# EAGLE design Maqam v3a (EAGLE 9.2.2)

## Sheet 1 of 2: Maqam v2.0 Board
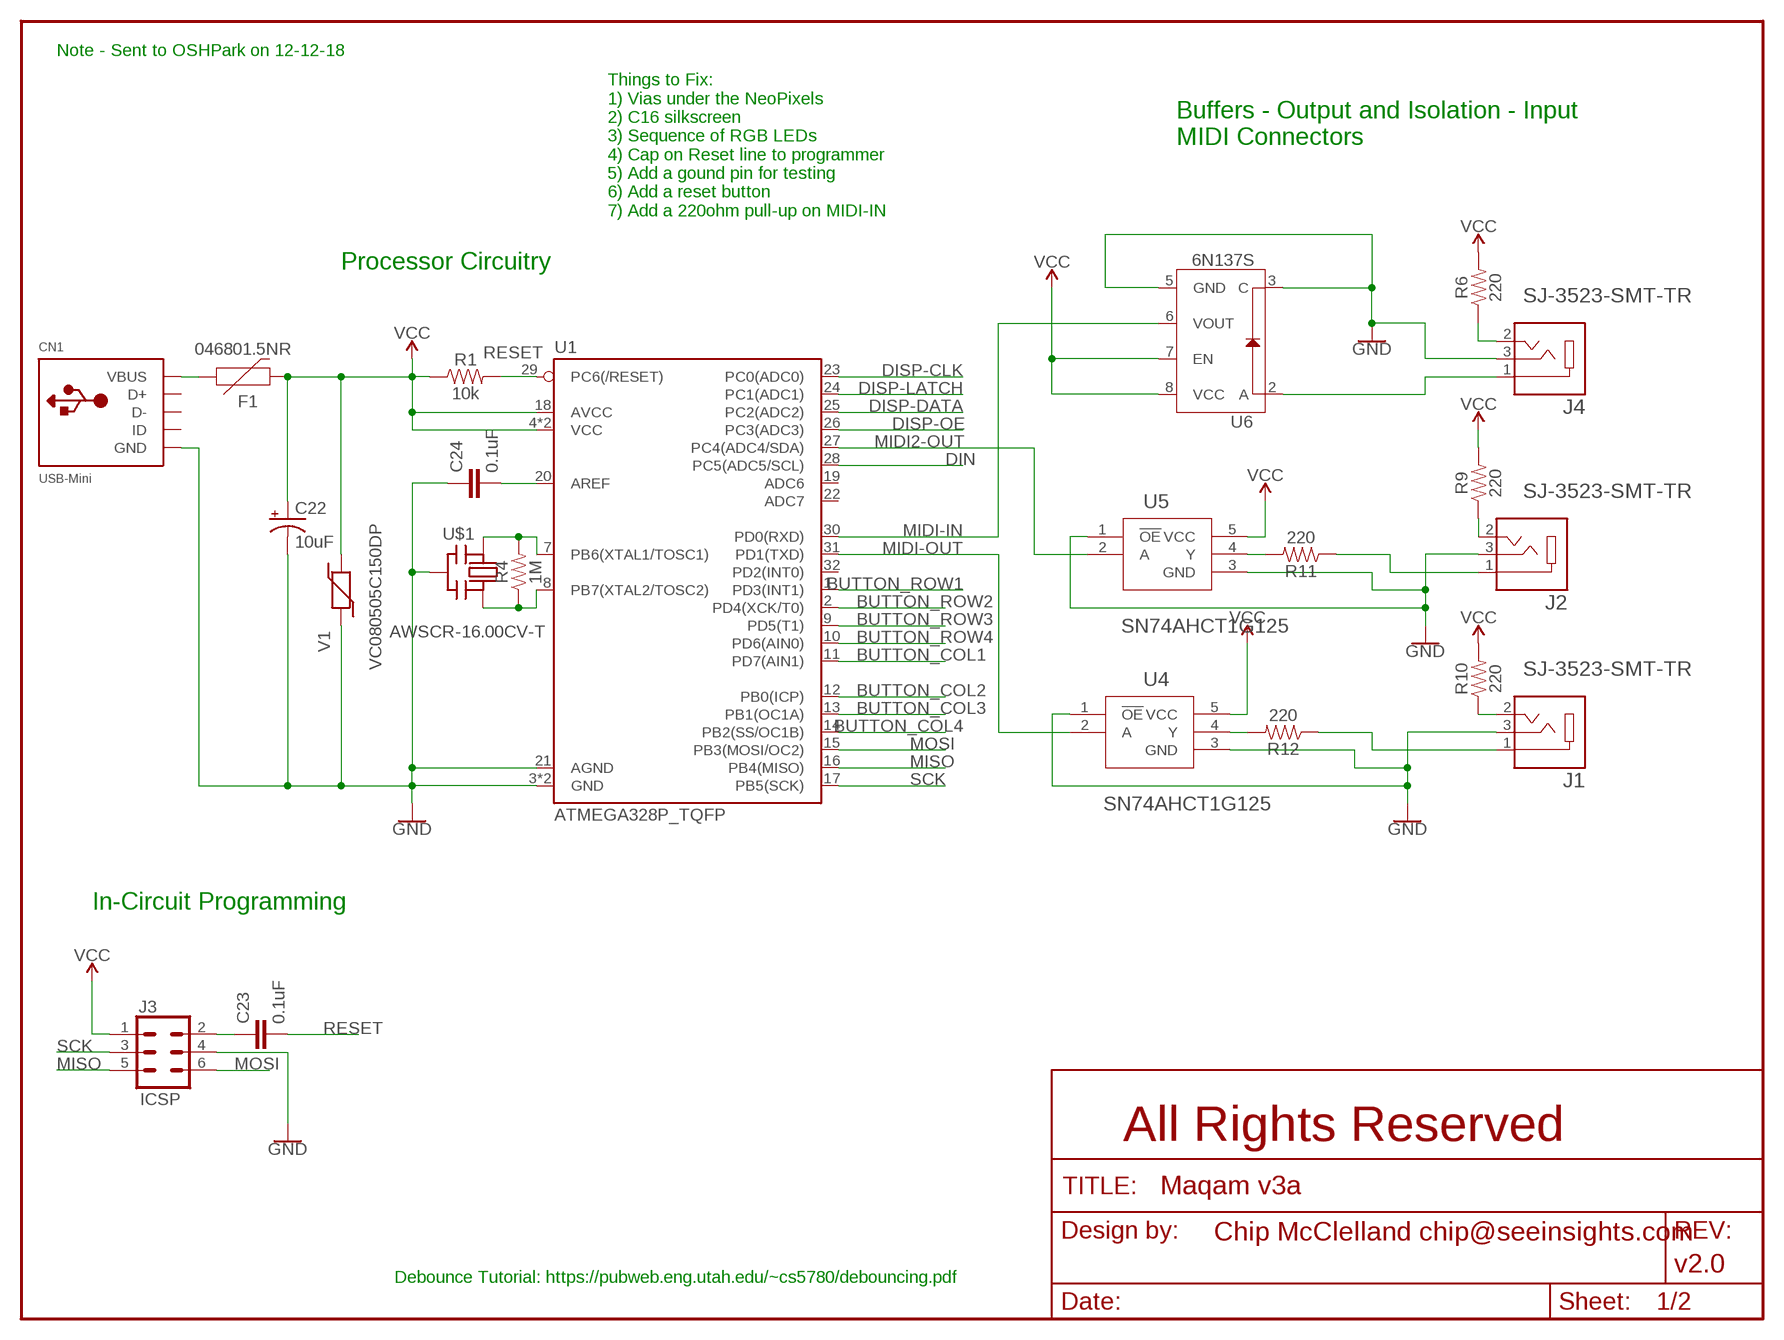
[diagram p0: schematic, sheet 1]

### Parts
C22  10uF  10UF-POLAR-EIA3216-16V-10%(TANT)  [EIA3216]
C23  0.1uF  1.0UF-0805-25V-(+80/-20%)  [0805]
C24  0.1uF  1.0UF-0805-25V-(+80/-20%)  [0805]
CN1  USB-Mini  USBMINIB  [USB-MINIB]
F1  046801.5NR  PPTC_HALF-AMP  [1206]
FRAME2  FRAME-LETTERNO_PACKAGE  [DUMMY]
J1  SJ-3523-SMT-TR  [CUI_SJ-3523-SMT-TR]
J2  SJ-3523-SMT-TR  [CUI_SJ-3523-SMT-TR]
J3  ICSP  CONN_03X2SHROUD  [2X3-SHROUDED]
J4  SJ-3523-SMT-TR  [CUI_SJ-3523-SMT-TR]
R1  10k  RESISTOR0805  [0805]
R4  1M  RESISTOR0805  [0805]
R6  220  RESISTOR0805  [0805]
R9  220  RESISTOR0805  [0805]
R10  220  RESISTOR0805  [0805]
R11  220  RESISTOR0805  [0805]
R12  220  RESISTOR0805  [0805]
U1  ATMEGA328P_TQFP  [TQFP32-08]
U4  SN74AHCT1G125  SN74AHCT1G125DBVRDBV5-L  [DBV5-L]
U5  SN74AHCT1G125  SN74AHCT1G125DBVRDBV5-L  [DBV5-L]
U6  6N137S  [8-SMD]
U$1  AWSCR-16.00CV-T  CERMOSCILL  [AWSCR]
V1  VC080505C150DP  VARISTOR  [0805]

### Nets
BUTTON_COL1: U1.11(PD7(AIN1)) ; also sheet 2
BUTTON_COL2: U1.12(PB0(ICP)) ; also sheet 2
BUTTON_COL3: U1.13(PB1(OC1A)) ; also sheet 2
BUTTON_COL4: U1.14(PB2(SS/OC1B)) ; also sheet 2
BUTTON_ROW1: U1.1(PD3(INT1)) ; also sheet 2
BUTTON_ROW2: U1.2(PD4(XCK/T0)) ; also sheet 2
BUTTON_ROW3: U1.9(PD5(T1)) ; also sheet 2
BUTTON_ROW4: U1.10(PD6(AIN0)) ; also sheet 2
DIN: U1.28(PC5(ADC5/SCL)) ; also sheet 2
DISP-CLK: U1.23(PC0(ADC0)) ; also sheet 2
DISP-DATA: U1.25(PC2(ADC2)) ; also sheet 2
DISP-LATCH: U1.24(PC1(ADC1)) ; also sheet 2
DISP-OE: U1.26(PC3(ADC3)) ; also sheet 2
GND: C22.- C24.1 CN1.GND J1.3 J2.3 J3.4 J4.3 U1.3(GND) U1.5(GND) U1.21(AGND) U4.1(!OE) U4.3(GND) U5.1(!OE) U5.3(GND) U6.3(C) U6.5(GND) U$1.2(GND) V1.1 ; also sheet 2
MIDI2-OUT: U1.27(PC4(ADC4/SDA)) U5.2(A)
MIDI-IN: U1.30(PD0(RXD)) U6.6(VOUT)
MIDI-OUT: U1.31(PD1(TXD)) U4.2(A)
MISO: J3.5 U1.16(PB4(MISO))
MOSI: J3.6 U1.15(PB3(MOSI/OC2))
N$14: C24.2 U1.20(AREF)
N$15: J1.1 R12.1
N$16: R4.1 U1.8(PB7(XTAL2/TOSC2)) U$1.3(OUT)
N$22: C23.1 J3.2
N$24: R4.2 U1.7(PB6(XTAL1/TOSC1)) U$1.1(IN)
N$26: J2.1 R11.1
N$27: J4.2 R6.1
N$28: J4.1 U6.2(A)
N$38: J1.2 R10.1
N$39: J2.2 R9.1
N$40: R12.2 U4.4(Y)
N$41: R11.2 U5.4(Y)
N$43: CN1.VBUS F1.1
RESET: C23.2 R1.2 U1.29(PC6(/RESET))
SCK: J3.3 U1.17(PB5(SCK))
VCC: C22.+ F1.2 J3.1 R1.1 R6.2 R9.2 R10.2 U1.4(VCC) U1.6(VCC) U1.18(AVCC) U4.5(VCC) U5.5(VCC) U6.7(EN) U6.8(VCC) V1.2 ; also sheet 2
Unconnected: CN1.D+ CN1.D- CN1.ID U1.19(ADC6) U1.22(ADC7) U1.32(PD2(INT0))

### Notes on the sheet
- Note - Sent to OSHPark on 12-12-18
- Buffers - Output and Isolation - Input
  MIDI Connectors
- Things to Fix:
  1) Vias under the NeoPixels
  2) C16 silkscreen
  3) Sequence of RGB LEDs
  4) Cap on Reset line to programmer
  5) Add a gound pin for testing
  6) Add a reset button
  7) Add a 220ohm pull-up on MIDI-IN
- Processor Circuitry
- In-Circuit Programming
- All Rights Reserved
- Debounce Tutorial: https://pubweb.eng.utah.edu/~cs5780/debouncing.pdf

## Sheet 2 of 2
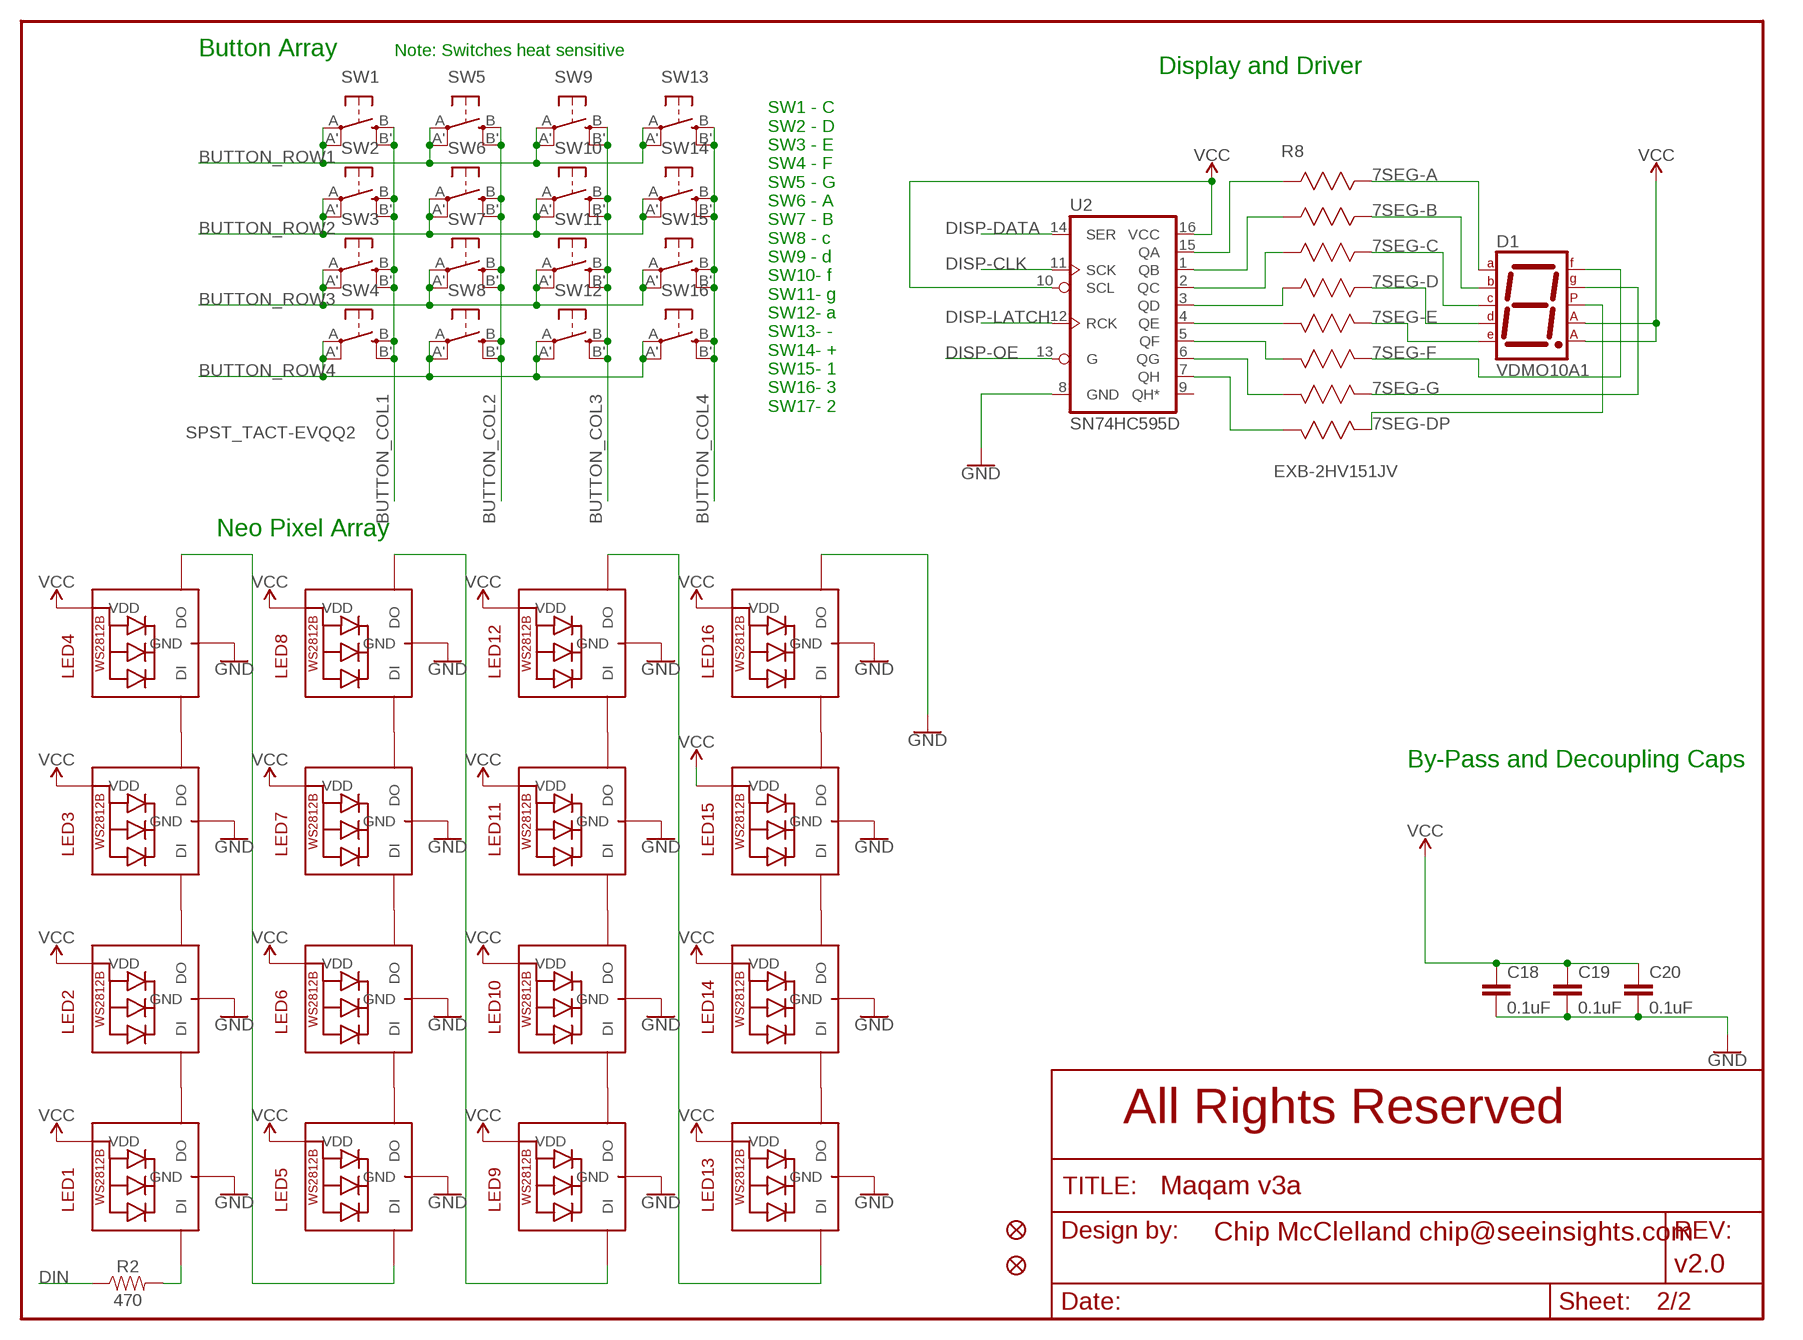
[diagram p1: schematic, sheet 2]

### Parts
C18  0.1uF  1.0UF-0805-25V-(+80/-20%)  [0805]
C19  0.1uF  1.0UF-0805-25V-(+80/-20%)  [0805]
C20  0.1uF  1.0UF-0805-25V-(+80/-20%)  [0805]
D1  VDMO10A1  [7-SEG-SMD]
FD1  FIDUCIALUFIDUCIAL  [FIDUCIAL-MICRO]
FD2  FIDUCIALUFIDUCIAL  [FIDUCIAL-MICRO]
FRAME1  FRAME-LETTERNO_PACKAGE  [DUMMY]
LED1  WS2812B3535  [LED3535]
LED2  WS2812B3535  [LED3535]
LED3  WS2812B3535  [LED3535]
LED4  WS2812B3535  [LED3535]
LED5  WS2812B3535  [LED3535]
LED6  WS2812B3535  [LED3535]
LED7  WS2812B3535  [LED3535]
LED8  WS2812B3535  [LED3535]
LED9  WS2812B3535  [LED3535]
LED10  WS2812B3535  [LED3535]
LED11  WS2812B3535  [LED3535]
LED12  WS2812B3535  [LED3535]
LED13  WS2812B3535  [LED3535]
LED14  WS2812B3535  [LED3535]
LED15  WS2812B3535  [LED3535]
LED16  WS2812B3535  [LED3535]
R2  470  RESISTOR0805  [0805]
R8  EXB-2HV151JV  EXB-2HV103JVEXB2HV-L  [EXB2HV-L]
SW1  SPST_TACT-EVQQ2  [EVQ-Q2]
SW2  SPST_TACT-EVQQ2  [EVQ-Q2]
SW3  SPST_TACT-EVQQ2  [EVQ-Q2]
SW4  SPST_TACT-EVQQ2  [EVQ-Q2]
SW5  SPST_TACT-EVQQ2  [EVQ-Q2]
SW6  SPST_TACT-EVQQ2  [EVQ-Q2]
SW7  SPST_TACT-EVQQ2  [EVQ-Q2]
SW8  SPST_TACT-EVQQ2  [EVQ-Q2]
SW9  SPST_TACT-EVQQ2  [EVQ-Q2]
SW10  SPST_TACT-EVQQ2  [EVQ-Q2]
SW11  SPST_TACT-EVQQ2  [EVQ-Q2]
SW12  SPST_TACT-EVQQ2  [EVQ-Q2]
SW13  SPST_TACT-EVQQ2  [EVQ-Q2]
SW14  SPST_TACT-EVQQ2  [EVQ-Q2]
SW15  SPST_TACT-EVQQ2  [EVQ-Q2]
SW16  SPST_TACT-EVQQ2  [EVQ-Q2]
U2  SN74HC595D  74HC595D  [SO16]

### Nets
7SEG-A: D1.7SEG7(A) R8.16
7SEG-B: D1.7SEG6(B) R8.15
7SEG-C: D1.7SEG4(C) R8.14
7SEG-D: D1.7SEG2(D) R8.13
7SEG-DP: D1.7SEG5(DP) R8.9
7SEG-E: D1.7SEG1(E) R8.12
7SEG-F: D1.7SEG9(F) R8.11
7SEG-G: D1.7SEG10(G) R8.10
BUTTON_COL1: SW1.B'(S1) SW1.B(S) SW2.B'(S1) SW2.B(S) SW3.B'(S1) SW3.B(S) SW4.B'(S1) SW4.B(S) ; also sheet 1
BUTTON_COL2: SW5.B'(S1) SW5.B(S) SW6.B'(S1) SW6.B(S) SW7.B'(S1) SW7.B(S) SW8.B'(S1) SW8.B(S) ; also sheet 1
BUTTON_COL3: SW9.B'(S1) SW9.B(S) SW10.B'(S1) SW10.B(S) SW11.B'(S1) SW11.B(S) SW12.B'(S1) SW12.B(S) ; also sheet 1
BUTTON_COL4: SW13.B'(S1) SW13.B(S) SW14.B'(S1) SW14.B(S) SW15.B'(S1) SW15.B(S) SW16.B'(S1) SW16.B(S) ; also sheet 1
BUTTON_ROW1: SW1.A'(P1) SW1.A(P) SW5.A'(P1) SW5.A(P) SW9.A'(P1) SW9.A(P) SW13.A'(P1) SW13.A(P) ; also sheet 1
BUTTON_ROW2: SW2.A'(P1) SW2.A(P) SW6.A'(P1) SW6.A(P) SW10.A'(P1) SW10.A(P) SW14.A'(P1) SW14.A(P) ; also sheet 1
BUTTON_ROW3: SW3.A'(P1) SW3.A(P) SW7.A'(P1) SW7.A(P) SW11.A'(P1) SW11.A(P) SW15.A'(P1) SW15.A(P) ; also sheet 1
BUTTON_ROW4: SW4.A'(P1) SW4.A(P) SW8.A'(P1) SW8.A(P) SW12.A'(P1) SW12.A(P) SW16.A'(P1) SW16.A(P) ; also sheet 1
DIN: R2.1 ; also sheet 1
DISP-CLK: U2.11(SCK) ; also sheet 1
DISP-DATA: U2.14(SER) ; also sheet 1
DISP-LATCH: U2.12(RCK) ; also sheet 1
DISP-OE: U2.13(G) ; also sheet 1
GND: C18.2 C19.2 C20.2 LED1.4(GND) LED2.4(GND) LED3.4(GND) LED4.4(GND) LED5.4(GND) LED6.4(GND) LED7.4(GND) LED8.4(GND) LED9.4(GND) LED10.4(GND) LED11.4(GND) LED12.4(GND) LED13.4(GND) LED14.4(GND) LED15.4(GND) LED16.3(DO) LED16.4(GND) U2.8(GND) ; also sheet 1
N$1: LED1.3(DO) LED2.1(DI)
N$2: LED3.3(DO) LED4.1(DI)
N$3: LED2.3(DO) LED3.1(DI)
N$4: LED7.3(DO) LED8.1(DI)
N$5: LED6.3(DO) LED7.1(DI)
N$6: LED5.3(DO) LED6.1(DI)
N$7: LED11.3(DO) LED12.1(DI)
N$8: LED10.3(DO) LED11.1(DI)
N$9: LED9.3(DO) LED10.1(DI)
N$10: LED15.3(DO) LED16.1(DI)
N$11: LED4.3(DO) LED5.1(DI)
N$12: LED8.3(DO) LED9.1(DI)
N$13: LED13.3(DO) LED14.1(DI)
N$17: R8.1 U2.15(QA)
N$18: LED14.3(DO) LED15.1(DI)
N$20: R8.5 U2.4(QE)
N$21: R8.2 U2.1(QB)
N$23: R8.3 U2.2(QC)
N$25: LED1.1(DI) R2.2
N$30: R8.4 U2.3(QD)
N$32: R8.6 U2.5(QF)
N$34: R8.7 U2.6(QG)
N$36: R8.8 U2.7(QH)
N$46: LED12.3(DO) LED13.1(DI)
VCC: C18.1 C19.1 C20.1 D1.7SEG3(CA1) D1.7SEG8(CA2) LED1.2(VDD) LED2.2(VDD) LED3.2(VDD) LED4.2(VDD) LED5.2(VDD) LED6.2(VDD) LED7.2(VDD) LED8.2(VDD) LED9.2(VDD) LED10.2(VDD) LED11.2(VDD) LED12.2(VDD) LED13.2(VDD) LED14.2(VDD) LED15.2(VDD) LED16.2(VDD) U2.10(SCL) U2.16(VCC) ; also sheet 1
Unconnected: U2.9(QH*)

### Notes on the sheet
- Button Array | Note: Switches heat sensitive
- Display and Driver
- SW1 - C
  SW2 - D
  SW3 - E
  SW4 - F
  SW5 - G
  SW6 - A
  SW7 - B
  SW8 - c
  SW9 - d
  SW10- f
  SW11- g
  SW12- a
  SW13- -
  SW14- +
  SW15- 1
  SW16- 3
  SW17- 2
- Neo Pixel Array
- By-Pass and Decoupling Caps
- All Rights Reserved

## Library data of the parts
C18-C20 C23 C24 = SparkFun-Capacitors:1.0UF: 1µF ceramic capacitors A capacitor is a passive two-terminal electrical component used to store electrical energy temporarily in an electric field.; PROD_ID: CAP-11625; VALUE: 1.0uF
C22 = SparkFun-Capacitors:10UF-POLAR: 10.0µF polarized capacitors A capacitor is a passive two-terminal electrical component used to store electrical energy temporarily in an electric field.; PROD_ID: CAP-00811
CN1 = adafruit:USB: USB Connectors USBMINIB - Surface Mount Female Mini-B USB Connector 4UConnector: 06564 By microbuilder.eu Thru-hole RA Female Mini-B USB Connector 4UConnector: 18732 By ladyada.net
D1 = Custom Components:VDMO10A1
F1 = SparkFun-Fuses:PPTC: Resettable Fuse PPTC Resettable Fuse. Really a sort of resistor with a polymeric positive temperature coefficient whose resistance increases dramatically with an increase in temperature. When heated by the power passing through the resistance rises causing the current to be limited, protecting the circuit. This is achieved by the transition of the polymer from a crystalline to an amorphous state where the conductive carbon separates breaking the conductive pathways found in the cool crystalline structure. When a PPTC cools back down it resumes conducting letting the circuit turn back on. SparkFun Products: SparkFun RedBoard - Programmed with Arduino <https://www.sparkfun.com/products/12757> Pro Micro - 5V/16MHz <https://www.sparkfun.com/products/12640> Arduino Pro 328 - 5V/16MHz <https://www.sparkfun.com/products/10915> MP3 Trigger <https://www.sparkfun.com/products/13720>; PROD_ID: RES-08585; VALUE: 6V/0.5A
FD1 FD2 = SparkFun-Aesthetics:FIDUCIAL: Fiducial Alignment Points Point-of-reference for pick-and-place machines and other optical instruments.
FRAME1 FRAME2 = SparkFun-Aesthetics:FRAME-LETTER: Schematic Frame - Letter Standard 8.5x11 US Letter frame; DESIGNER: Chip McClelland chip@seeinsights.com; REV: v2.0; VERSION: v2.0
J1 J2 J4 = SJ-3523-SMT-TR:SJ-3523-SMT-TR: Audio Jack Connector 3.5 mm Low Profile Surface Mount Stereo Jack, 3 Pin Right-Angle; CUI_PURCHASE_URL: https://www.cui.com/product/interconnect/audio-connectors/3.5-mm-jacks/sj-352x-smt-series?utm_source=snapeda.com&utm_medium=referral&utm_campaign=snapedaBOM; DESCRIPTION: SJ Series 3.5 mm 12 V SMT Right Angle Stereo Audio Jack; DIGI-KEY_PART_NUMBER: CP-3523SJCT-ND; DIGI-KEY_PURCHASE_URL: https://www.digikey.com/product-detail/en/cui-inc/SJ-3523-SMT-TR/CP-3523SJCT-ND/669704?utm_source=snapeda&utm_medium=aggregator&utm_campaign=symbol; MF: CUI Inc.; MP: SJ-3523-SMT-TR; PACKAGE: LGA-10 STMicroelectronics
J3 = SparkFun-Connectors:CONN_03X2: Multi connection point. Often used as Generic Header-pin footprint for 0.1 inch spaced/style header connections You can populate with any combo of single row headers, but if you'd like an exact match, check these: Header - 2x3 (Male, 0.1") <https://www.sparkfun.com/products/12807> (PRT-12807) Header - 2x3 (Female, 0.1") <https://www.sparkfun.com/products/13010> (PRT-13010) 2x3 Pin Shrouded Header <https://www.sparkfun.com/products/10877> (PRT-10877) On any of the 0.1 inch spaced packages, you can populate with these: Break Away Headers - Straight <https://www.sparkfun.com/products/116> (PRT-00116) Break Away Male Headers - Right Angle <https://www.sparkfun.com/products/553> (PRT-00553) Female Headers <https://www.sparkfun.com/products/115> (PRT-00115) Break Away Headers - Machine Pin <https://www.sparkfun.com/products/117> (PRT-00117) Break Away Female Headers - Swiss Machine Pin <https://www.sparkfun.com/products/743> (PRT-00743) Special note: the shrouded connector mates well with our 3x2 ribbon cables: Ribbon Crimp Connector - 6-pin (2x3, Female) <https://www.sparkfun.com/products/10651> (PRT-10651) Ribbon Cable - 6 wire (15ft) <https://www.sparkfun.com/products/10646> (PRT-10646); PROD_ID: CONN-10681; SF_ID: PRT_10877
LED1-LED16 = adafruit:WS2812B
R1 R2 R4 R6 R9-R12 = SparkFun-Resistors:RESISTOR: Generic Resistor Package
R8 = Custom Components:EXB-2HV103JV; MANUFACTURER_PART_NUMBER: EXB2HV103JV; VENDOR: Panasonic
SW1-SW16 = adafruit:SPST_TACT: SMT 6mm switch, EVQQ2 series http://www.ladyada.net/library/eagle
U1 = SparkFun-IC-Microcontroller:ATMEGA328P_TQFP: Popular 328P in QFP Storefront component: ATmega328 - TQFP <https://www.sparkfun.com/products/13448> (COM-13448) Datasheet <http://www.sparkfun.com/datasheets/Components/SMD/ATMega328.pdf> SparkFun Products SparkFun RedBoard - Programmed with Arduino <https://www.sparkfun.com/products/12757> (DEV-12757) Arduino Pro Mini 328 - 5V/16MHz <https://www.sparkfun.com/products/11113> (DEV-11113) Arduino Pro Mini 328 - 3.3V/8MHz <https://www.sparkfun.com/products/11114> (DEV-11114) SparkFun OpenLog <https://www.sparkfun.com/products/13712> (DEV-13712) SparkFun MicroView - OLED Arduino Module <https://www.sparkfun.com/products/12923> (DEV-12923) SparkFun Digital Sandbox <https://www.sparkfun.com/products/12651> (DEV-12651) SparkFun PicoBoard <https://www.sparkfun.com/products/11888> (WIG-11888) Arduino Fio <https://www.sparkfun.com/products/10116> (DEV-10116) LilyPad Arduino 328 Main Board <https://www.sparkfun.com/products/13342> (DEV-13342) SparkFun RedStick <https://www.sparkfun.com/products/13741> (DEV-13741) LilyPad MP3 <https://www.sparkfun.com/products/11013> (DEV-11013) LilyPad Arduino SimpleSnap <https://www.sparkfun.com/products/10941> (DEV-10941) SparkFun Stepoko <https://www.sparkfun.com/products/13899> (ROB-13899) SparkFun Geiger Counter <https://www.sparkfun.com/products/11345> (SEN-11345) SparkFun EL Sequencer <https://www.sparkfun.com/products/12781> (COM-12781) Arduino Pro 328 - 5V/16MHz <https://www.sparkfun.com/products/10915> (DEV-10915) CryptoCape <https://www.sparkfun.com/products/12773> (DEV-12773) SparkFun IR Thermometer Evaluation Board - MLX90614 <https://www.sparkfun.com/products/10740> (SEN-10740) SparkFun RedBot Mainboard <https://www.sparkfun.com/products/12097> (ROB-12097) Arduino Pro 328 - 3.3V/8MHz <https://www.sparkfun.com/products/10914> (DEV-10914) SparkFun Block for Intel® Edison - Arduino <https://www.sparkfun.com/products/13036> (DEV-13036) SparkFun Simon Says - Surface Mount Soldering Kit <https://www.sparkfun.com/products/10935> (KIT-10935) SparkFun 7-Segment Serial Display - Red <https://www.sparkfun.com/products/11441> (COM-11441) SparkFun 7-Segment Serial Display - White <https://www.sparkfun.com/products/11629> (COM-11629) SparkFun 7-Segment Serial Display - Yellow <https://www.sparkfun.com/products/11443> (COM-11443) SparkFun 7-Segment Serial Display - Kelly Green <https://www.sparkfun.com/products/11440> (COM-11440) SparkFun 7-Segment Serial Display - Blue <https://www.sparkfun.com/products/11442> (COM-11442) SparkFun OpenSegment Serial Display - 20mm (Blue) <https://www.sparkfun.com/products/11647> (COM-11647) SparkFun OpenSegment Serial Display - 20mm (Green) <https://www.sparkfun.com/products/11646> (COM-11646) SparkFun OpenSegment Serial Display - 20mm (White) <https://www.sparkfun.com/products/11648> (COM-11648) SparkFun OpenSegment Serial Display - 20mm (Red) <https://www.sparkfun.com/products/11644> (COM-11644) SparkFun OpenSegment Serial Display - 20mm (Yellow) <https://www.sparkfun.com/products/11645> (COM-11645) SparkFun OpenSegment Shield <https://www.sparkfun.com/products/13190> (DEV-13190); PROD_ID: IC-09069
U2 = SparkFun-IC-Logic:74*595: 8-Bit Shift Register (Serial to Parallel) Datasheet <http://cdn.sparkfun.com/datasheets/BreakoutBoards/MM74HC595.pdf> SparkFun Products SparkFun Shift Register Breakout - 74HC595 <https://www.sparkfun.com/products/10680> (BOB-10680); PROD_ID: IC-07875
U4 U5 = Custom Components:SN74AHCT1G125DBVR; MANUFACTURER_PART_NUMBER: SN74AHCT1G125DBVR; VENDOR: Texas Instruments
U6 = SparkFun-DiscreteSemi:6N137S: Lite-On 6N137 - High Speed Opto Isolator Opto isolator capable of data rates up to 10MBd; PROD_ID: IC-14151
U$1 = adafruit:CERMOSCILL: Ceramic oscillator with built in capacitors such as ZTT-12MHz http://www.ladyada.net/library/eagle
V1 = Custom Components:VARISTOR

## Net classes
0 default: width 0.203 mm, drill 0.33 mm

## Board
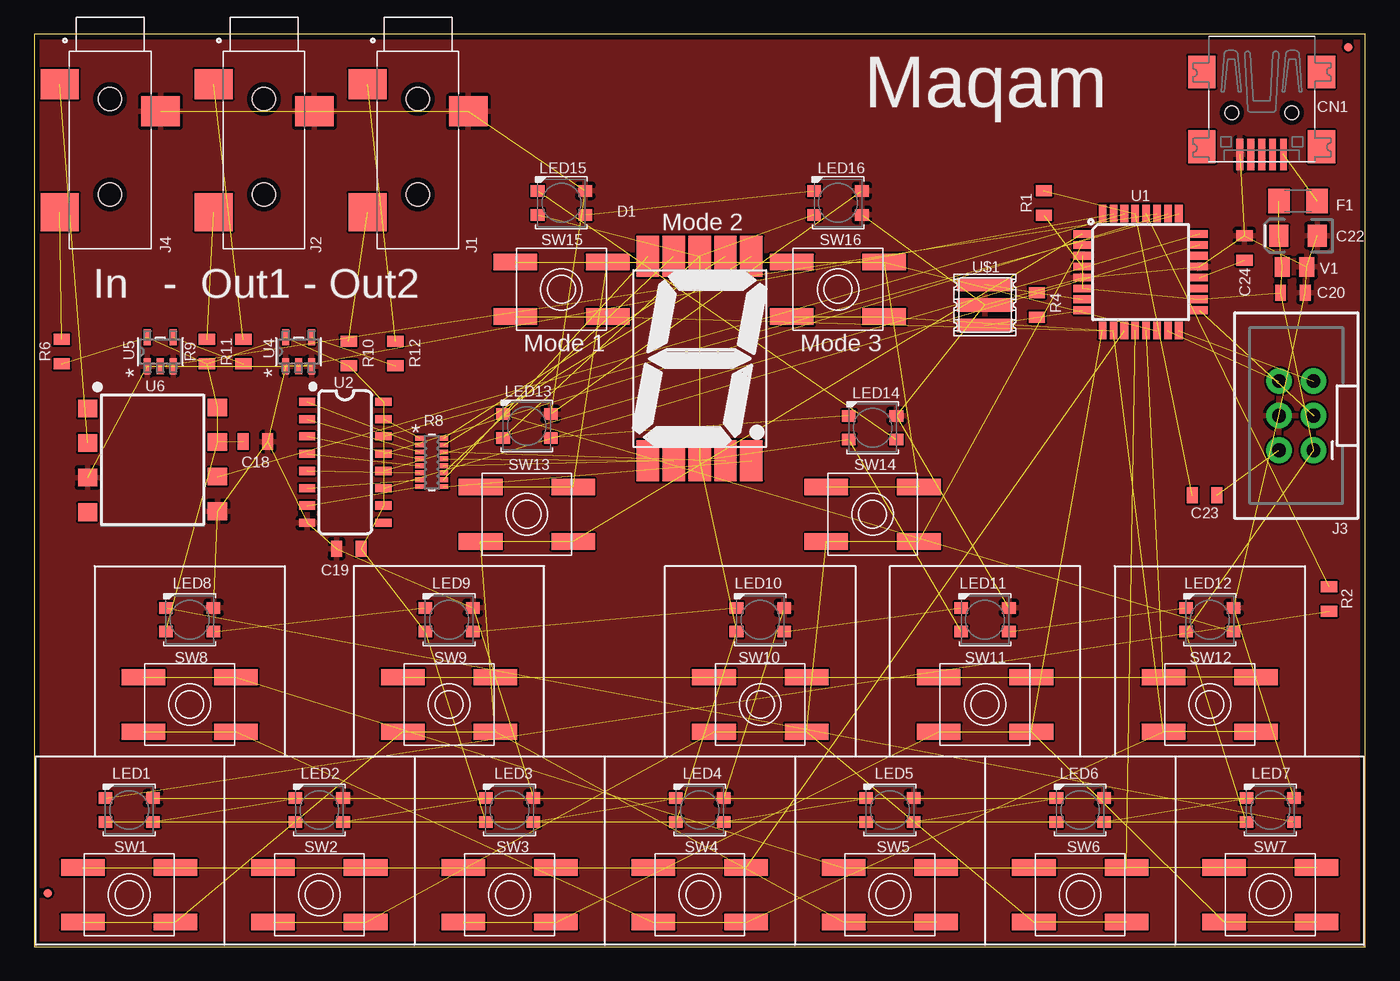
[diagram p2: board, top side]
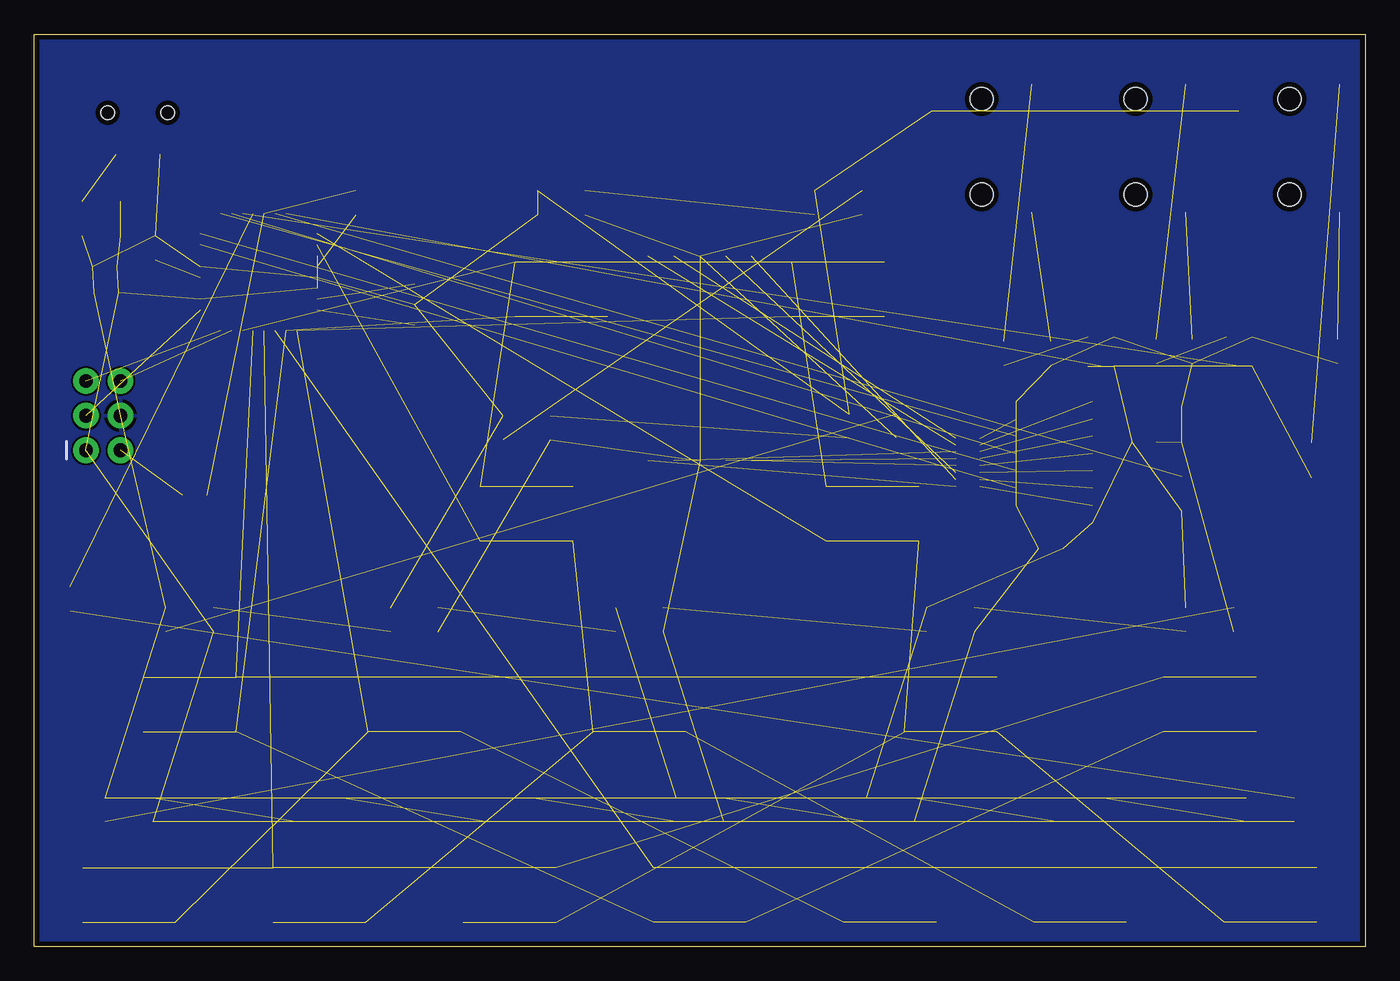
[diagram p3: board, bottom side, seen from below]

Size 97.79 x 67.01 mm. Coordinates in mm from the lower left corner, seen from the top.
Outline: 0,0 97.79,0 97.79,67 0,67 0,0
Copper layers (1*16): Top 0.035559375mm / dielectric 1.6mm / Bottom 0.035559375mm
Design rules "oshpark-2layer": minimum track width 6mil, minimum drill 10mil, track to track 6mil, track to pad 6mil, pad to pad 6mil, via to via 6mil, smd to smd 6mil, copper to edge 15mil, drill to drill 6mil, minimum pad ring 5mil, minimum via ring 5mil, stop-mask expansion 2.5mil, vias tented up to drill 0mil, thermal gap 10mil

### Footprints (pad centres in the part's own frame; a part is rotated, then mirrored left to right if it is on the bottom)
0805 = smd 0.8 x 1.2: 1 -0.9,0; 2 0.9,0
EIA3216 = smd 1.4 x 1.6: + 1.4,0; - -1.4,0
USB-MINIB = smd 0.5 x 2.308: D+ 0,4.064; D- -0.8,4.064; GND 1.6,4.064; ID 0.8,4.064; VBUS -1.6,4.064 | smd 2 x 2.4: GND1 -4.4,-2; GND2 -4.4,3.5; GND3 4.4,3.5; GND4 4.4,-2 | hole 1: -2.2,1; 2.2,1
7-SEG-SMD = smd 1.65 x 3: 7SEG1 -3.81,-7.5; 7SEG2 -1.91,-7.5; 7SEG3 -0.01,-7.5; 7SEG4 1.89,-7.5; 7SEG5 3.79,-7.5; 7SEG6 3.79,7.5; 7SEG7 1.89,7.5; 7SEG8 -0.01,7.5; 7SEG9 -1.91,7.5; 7SEG10 -3.81,7.5
1206 = smd 1.6 x 1.8: 1 -1.4,0; 2 1.4,0
FIDUCIAL-MICRO = smd 0.635 x 0.635: 1 0,0
CUI_SJ-3523-SMT-TR = smd 2.2 x 2.8: 1 -1.1,-3.7; 3 0.9,3.7 | smd 2.8 x 2.8: 2 8.3,-3.7 | hole 1.7: 0,0; 7,0
2X3-SHROUDED = drill 1.016 pad 1.88: 1 -1.27,2.54; 2 1.27,2.54; 3 -1.27,0; 4 1.27,0; 5 -1.27,-2.54; 6 1.27,-2.54
LED3535 = smd 1 x 0.85: 1 -1.75,0.875; 2 -1.75,-0.875; 3 1.75,-0.875; 4 1.75,0.875
EXB2HV-L = smd 0.66 x 0.356: 1 -0.876,1.778; 2 -0.876,1.27; 3 -0.876,0.762; 4 -0.876,0.254; 5 -0.876,-0.254; 6 -0.876,-0.762; 7 -0.876,-1.27; 8 -0.876,-1.778; 9 0.876,-1.778; 10 0.876,-1.27; 11 0.876,-0.762; 12 0.876,-0.254; 13 0.876,0.254; 14 0.876,0.762; 15 0.876,1.27; 16 0.876,1.778
EVQ-Q2 = smd 3.2 x 1.2: A -3.4,-2; A' 3.4,-2; B -3.4,2; B' 3.4,2
TQFP32-08 = smd 1.27 x 0.559: 1 -4.293,2.8; 2 -4.293,2; 3 -4.293,1.2; 4 -4.293,0.4; 5 -4.293,-0.4; 6 -4.293,-1.2; 7 -4.293,-2; 8 -4.293,-2.8; 17 4.293,-2.8; 18 4.293,-2; 19 4.293,-1.2; 20 4.293,-0.4; 21 4.293,0.4; 22 4.293,1.2; 23 4.293,2; 24 4.293,2.8 | smd 0.559 x 1.27: 9 -2.8,-4.293; 10 -2,-4.293; 11 -1.2,-4.293; 12 -0.4,-4.293; 13 0.4,-4.293; 14 1.2,-4.293; 15 2,-4.293; 16 2.8,-4.293; 25 2.8,4.293; 26 2,4.293; 27 1.2,4.293; 28 0.4,4.293; 29 -0.4,4.293; 30 -1.2,4.293; 31 -2,4.293; 32 -2.8,4.293
SO16 = smd 0.6 x 1.2: 1 -4.445,-2.8; 2 -3.175,-2.8; 3 -1.905,-2.8; 4 -0.635,-2.8; 5 0.635,-2.8; 6 1.905,-2.8; 7 3.175,-2.8; 8 4.445,-2.8; 9 4.445,2.8; 10 3.175,2.8; 11 1.905,2.8; 12 0.635,2.8; 13 -0.635,2.8; 14 -1.905,2.8; 15 -3.175,2.8; 16 -4.445,2.8
DBV5-L = smd 1.168 x 0.508: 1 -1.067,0.95; 2 -1.067,0; 3 -1.067,-0.95; 4 1.067,-0.95; 5 1.067,0.95
8-SMD = smd 1.3 x 1.4: 1 -3.96,-4.96; 2 -1.42,-4.96; 3 1.12,-4.96; 4 3.66,-4.96; 5 3.59,4.58; 6 1.05,4.58; 7 -1.49,4.58; 8 -4.03,4.58
AWSCR = smd 1 x 4.1: 1 -1.5,0; 2 0,0; 3 1.5,0
0805' = smd 1.118 x 1.448: 1 -0.902,0; 2 0.902,0

### Placement (x,y rotation side)
C18  16.26,37.08 0 top
C19  23.11,29.21 180 top
C20  92.46,48.01 0 top
C22  92.84,52.2 180 top
C23  85.98,33.15 180 top
C24  88.9,51.31 270 top
CN1  90.17,62.23 180 top
D1  48.9,43.18 0 top
F1  92.84,54.74 180 top
FD1  96.52,66.04 0 top
FD2  1.02,3.94 0 top
FRAME1  21.59,-8.89 0 top  (outside the outline)
FRAME2  -6.35,-30.48 0 top  (outside the outline)
J1  28.19,62.23 270 top
J2  16.89,62.23 270 top
J3  92.71,38.99 180 top
J4  5.59,62.23 270 top
LED1  6.99,10.03 0 top
LED2  20.95,10.03 0 top
LED3  34.92,10.03 0 top
LED4  48.9,10.03 0 top
LED5  62.87,10.03 0 top
LED6  76.83,10.03 0 top
LED7  90.81,10.03 0 top
LED8  11.43,24 0 top
LED9  30.48,24 0 top
LED10  53.34,24 0 top
LED11  69.85,24 0 top
LED12  86.36,24 0 top
LED13  36.2,38.23 0 top
LED14  61.59,38.1 0 top
LED15  38.73,54.61 0 top
LED16  59.05,54.61 0 top
R1  74.17,54.61 90 top
R2  95.12,25.53 270 top
R4  73.66,47.12 90 top
R6  2.03,43.69 270 top
R8  29.21,35.56 0 top
R9  12.7,43.69 270 top
R10  23.11,43.56 270 top
R11  15.37,43.69 270 top
R12  26.54,43.56 270 top
SW1  6.99,3.81 0 top
SW2  20.95,3.81 0 top
SW3  34.92,3.81 0 top
SW4  48.9,3.81 0 top
SW5  62.87,3.81 0 top
SW6  76.83,3.81 0 top
SW7  90.81,3.81 0 top
SW8  11.43,17.78 0 top
SW9  30.48,17.78 0 top
SW10  53.34,17.78 0 top
SW11  69.85,17.78 0 top
SW12  86.36,17.78 0 top
SW13  36.2,31.75 0 top
SW14  61.59,31.75 0 top
SW15  38.73,48.26 0 top
SW16  59.05,48.26 0 top
U1  81.28,49.53 0 top
U2  22.86,35.56 270 top
U4  19.43,43.69 90 top
U5  9.27,43.69 90 top
U6  8.89,35.56 270 top
U$1  69.85,47.12 270 top
V1  VC080505C150DP  [0805']  92.58,49.91 180 top

### Tracks (layer width: path | path; a pad name or v marks a point on that pad's centre or on a via)
7SEG-A  (1 unrouted)
7SEG-B  (1 unrouted)
7SEG-C  (1 unrouted)
7SEG-D  (1 unrouted)
7SEG-DP  (1 unrouted)
7SEG-E  (1 unrouted)
7SEG-F  (1 unrouted)
7SEG-G  (1 unrouted)
BUTTON_COL1  (8 unrouted)
BUTTON_COL2  (8 unrouted)
BUTTON_COL3  (8 unrouted)
BUTTON_COL4  (8 unrouted)
BUTTON_ROW1  (8 unrouted)
BUTTON_ROW2  (8 unrouted)
BUTTON_ROW3  (8 unrouted)
BUTTON_ROW4  (8 unrouted)
DIN  (1 unrouted)
DISP-CLK  (1 unrouted)
DISP-DATA  (1 unrouted)
DISP-LATCH  (1 unrouted)
DISP-OE  (1 unrouted)
GND  (38 unrouted)
  pour Top: -5.59,69.85 101.35,69.85 101.35,-5.21 -5.71,-5.21 -5.71,69.85
  pour Bottom: -9.4,72.52 103.63,72.52 103.63,-8.51 -9.4,-8.51
MIDI2-OUT  (1 unrouted)
MIDI-IN  (1 unrouted)
MIDI-OUT  (1 unrouted)
MISO  (1 unrouted)
MOSI  (1 unrouted)
N$1  (1 unrouted)
N$2  (1 unrouted)
N$3  (1 unrouted)
N$4  (1 unrouted)
N$5  (1 unrouted)
N$6  (1 unrouted)
N$7  (1 unrouted)
N$8  (1 unrouted)
N$9  (1 unrouted)
N$10  (1 unrouted)
N$11  (1 unrouted)
N$12  (1 unrouted)
N$13  (1 unrouted)
N$14  (1 unrouted)
N$15  (1 unrouted)
N$16  (2 unrouted)
N$17  (1 unrouted)
N$18  (1 unrouted)
N$20  (1 unrouted)
N$21  (1 unrouted)
N$22  (1 unrouted)
N$23  (1 unrouted)
N$24  (2 unrouted)
N$25  (1 unrouted)
N$26  (1 unrouted)
N$27  (1 unrouted)
N$28  (1 unrouted)
N$30  (1 unrouted)
N$32  (1 unrouted)
N$34  (1 unrouted)
N$36  (1 unrouted)
N$38  (1 unrouted)
N$39  (1 unrouted)
N$40  (1 unrouted)
N$41  (1 unrouted)
N$43  (1 unrouted)
N$46  (1 unrouted)
RESET  (2 unrouted)
SCK  (1 unrouted)
VCC  (37 unrouted)

### Text on the board
tPlace: Maqam | Mode 2 | In - Out1 - Out2 | Mode 1 | Mode 3
bPlace: Maqam v2.0 / Chip McClelland, chip@seeinsights.com for / Mazeka INC / 12-12-2018 / All Rights Reserved